# EAGLE design Spannungsversorgung (EAGLE 4.16)
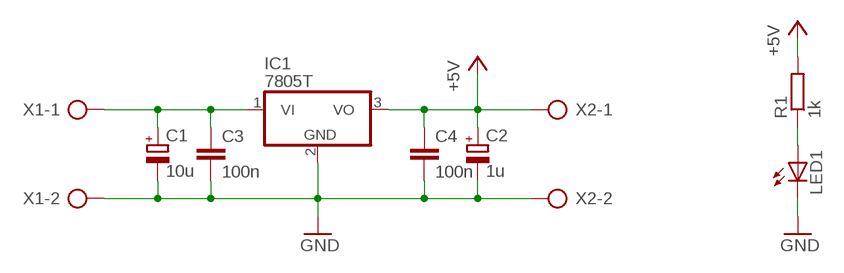
[diagram p0: schematic, sheet 1]

## Parts
C1  10u  CPOL-EUE2.5-7  [E2,5-7]
C2  1u  CPOL-EUE2.5-7  [E2,5-7]
C3  100n  C-EU025-030X050  [C025-030X050]
C4  100n  C-EU025-030X050  [C025-030X050]
IC1  7805T  [TO220H]
LED1  LED3MM  [LED3MM]
R1  1k  R-EU_0204/7  [0204/7]
X1  AK500/2  [AK500/2]
X2  AK500/2  [AK500/2]

## Nets
+5V: C2.+ C4.1 IC1.3(VO) R1.2 X2.1
GND: C1.- C2.- C3.2 C4.2 IC1.2(GND) LED1.K(C) X1.2 X2.2
N$1: C1.+ C3.1 IC1.1(VI) X1.1
N$2: LED1.A R1.1

## Library data of the parts
C1 C2 = rcl:CPOL-EU: POLARIZED CAPACITOR, European symbol
C3 C4 = rcl:C-EU: CAPACITOR, European symbol
IC1 = linear:78*: Positive VOLTAGE REGULATOR Source: http://cache.national.com/ds/LM/LM78L05.pdf http://www.fairchildsemi.com/ds/LM/LM7805.pdf
LED1 = led:LED: LED OSRAM: - CHIPLED LG R971, LG N971, LY N971, LG Q971, LY Q971, LO R971, LY R971 LH N974, LH R974 LS Q976, LO Q976, LY Q976 LO Q996 - Hyper CHIPLED LW Q18S LB Q993, LB Q99A, LB R99A - SideLED LS A670, LO A670, LY A670, LG A670, LP A670 LB A673, LV A673, LT A673, LW A673 LH A674 LY A675 LS A676, LA A676, LO A676, LY A676, LW A676 LS A679, LY A679, LG A679 - Hyper Micro SIDELED® LS Y876, LA Y876, LO Y876, LY Y876 LT Y87S - SmartLED LW L88C, LW L88S LB L89C, LB L89S, LG L890 LS L89K, LO L89K, LY L89K LS L896, LA L896, LO L896, LY L896 - TOPLED LS T670, LO T670, LY T670, LG T670, LP T670 LSG T670, LSP T670, LSY T670, LOP T670, LYG T670 LG T671, LOG T671, LSG T671 LB T673, LV T673, LT T673, LW T673 LH T674 LS T676, LA T676, LO T676, LY T676, LB T676, LH T676, LSB T676, LW T676 LB T67C, LV T67C, LT T67C, LS T67K, LO T67K, LY T67K, LW E67C LS E67B, LA E67B, LO E67B, LY E67B, LB E67C, LV E67C, LT E67C LW T67C LS T679, LY T679, LG T679 LS T770, LO T770, LY T770, LG T770, LP T770 LB T773, LV T773, LT T773, LW T773 LH T774 LS E675, LA E675, LY E675, LS T675 LS T776, LA T776, LO T776, LY T776, LB T776 LHGB T686 LT T68C, LB T68C - Hyper Mini TOPLED® LB M676 - Mini TOPLED Santana® LG M470 LS M47K, LO M47K, LY M47K Source: http://www.osram.convergy.de/
R1 = rcl:R-EU_: RESISTOR, European symbol
X1 X2 = con-ptr500:AK500/2: CONNECTOR

## Board
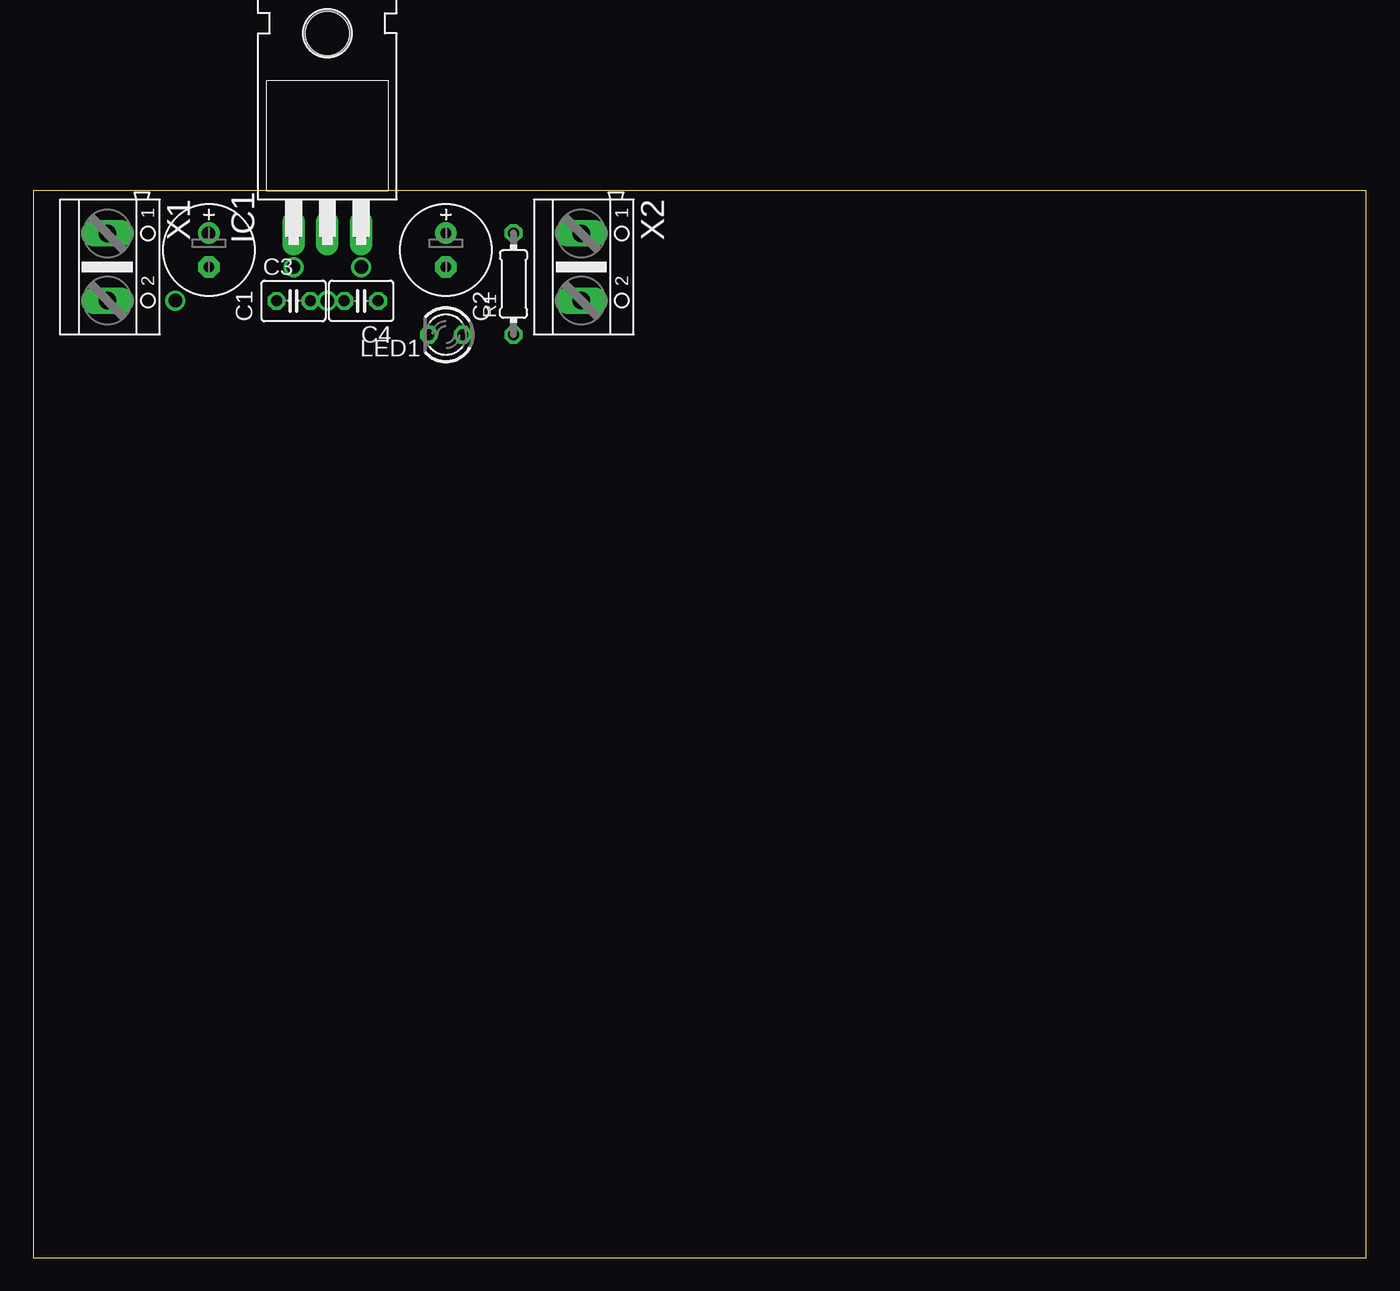
[diagram p1: board, top side]
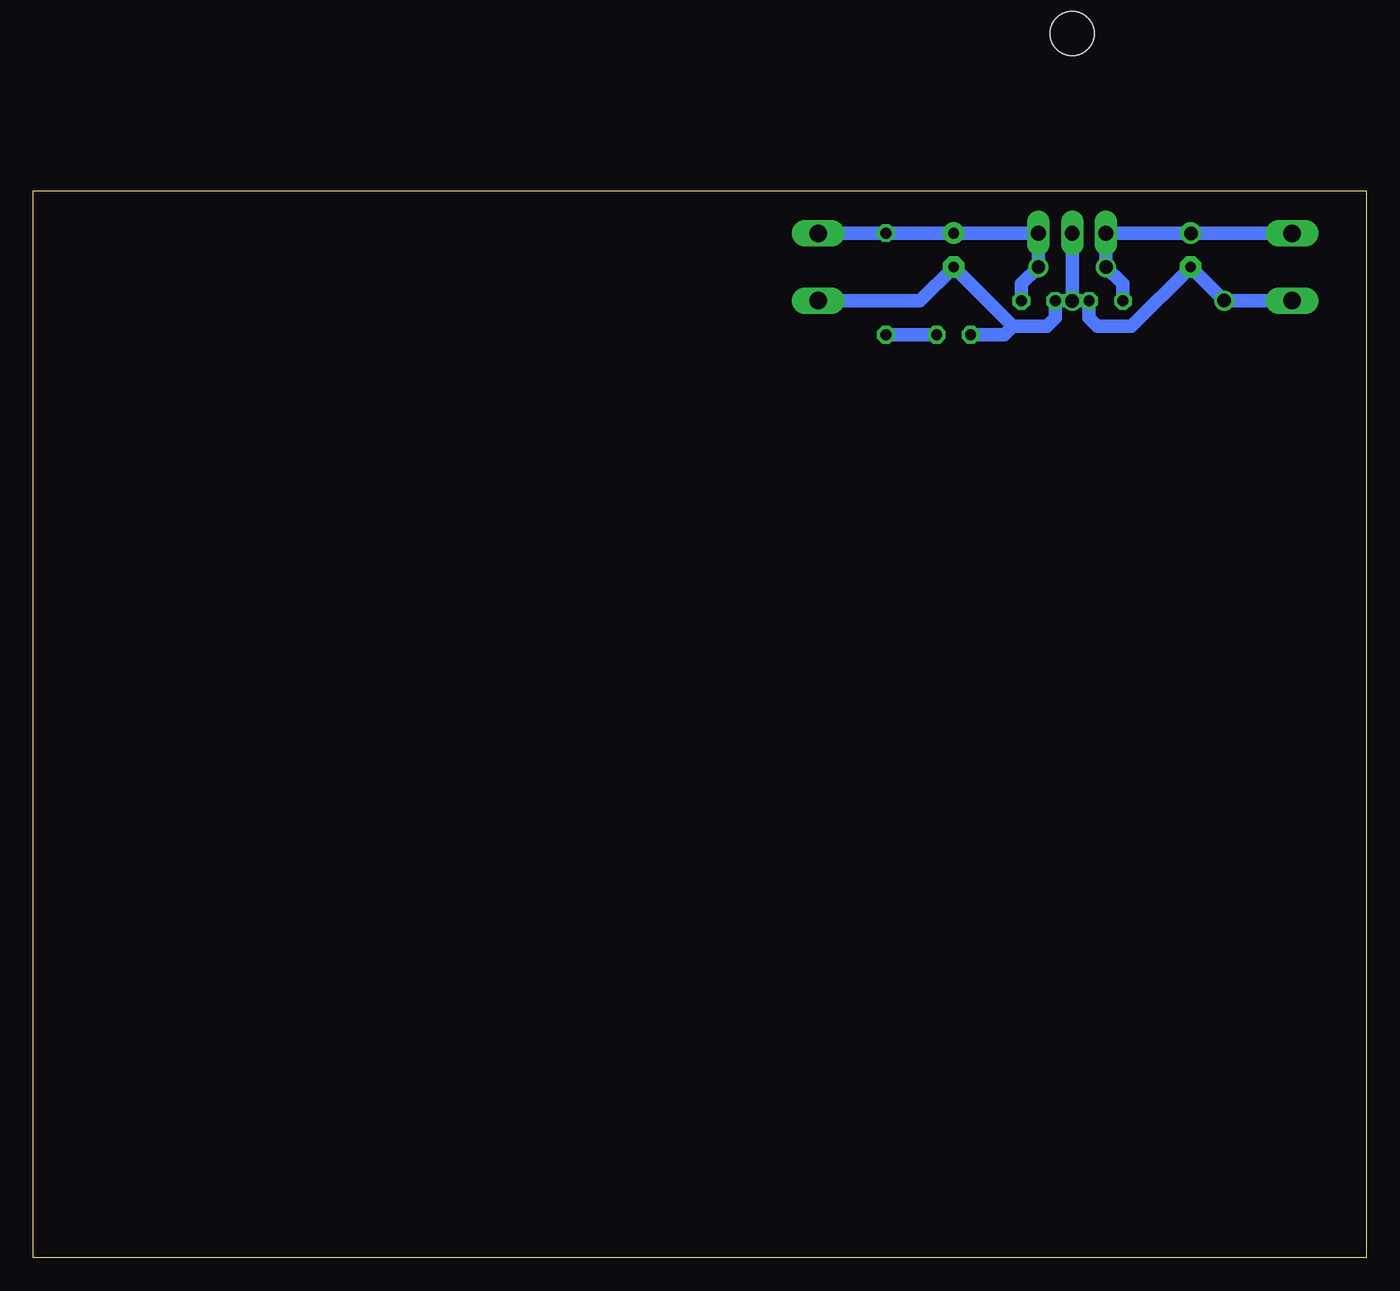
[diagram p2: board, bottom side, seen from below]

Size 100 x 80 mm. Coordinates in mm from the lower left corner, seen from the top.
Outline: 0,0 100,0 100,80 0,80 0,0
Copper layers (1*16): Top 0.035mm / dielectric 1.5mm / Bottom 0.035mm
Design rules "default": minimum track width 10mil, minimum drill 24mil, track to track 8mil, track to pad 8mil, pad to pad 8mil, via to via 8mil, smd to smd 8mil, copper to edge 40mil, drill to drill 8mil, minimum pad ring 10mil, minimum via ring 8mil, stop-mask expansion 4mil, vias tented up to drill 0mil, thermal gap 10mil

### Footprints (pad centres in the part's own frame; a part is rotated, then mirrored left to right if it is on the bottom)
E2,5-7 = drill 0.813 pad 1.6 round: + -1.27,0 | drill 0.813 pad 1.6 octagon: - 1.27,0
C025-030X050 = drill 0.813 octagon: 1 -1.27,0; 2 1.27,0
TO220H = drill 1.118 long: 1 -2.54,-10.16; 2 0,-10.16; 3 2.54,-10.16 | hole 3.302: 0,4.826
LED3MM = drill 0.813 octagon: A -1.27,0; K 1.27,0
0204/7 = drill 0.813 octagon: 1 -3.81,0; 2 3.81,0
AK500/2 = drill 1.321 long: 1 -2.515,0; 2 2.515,0

### Placement (x,y rotation side)
C1  13.17,75.56 270 top
C2  30.95,75.56 270 top
C3  19.52,71.75 0 top
C4  24.6,71.75 180 top
IC1  22.06,86.99 0 top
LED1  30.95,69.21 180 top
R1  36.03,73.02 90 top
X1  5.55,74.29 270 top
X2  41.11,74.29 270 top

### Tracks (layer width: path | path; a pad name or v marks a point on that pad's centre or on a via)
+5V  (via drill 1)
  Bottom 1.016: X2.1 32.24,76.8 C2.+ | C2.+ IC1.3 v24.6,74.29 25.87,73.02 C4.1 | C2.+ R1.2
GND  (via drill 1)
  Bottom 1.016: X1.2 v10.66,71.77 C1.- 17.61,69.84 20.15,69.84 20.79,70.48 C3.2 v22.06,71.75 | v22.06,71.75 C4.2 23.33,70.48 23.96,69.84 26.5,69.84 | v22.06,71.75 IC1.2 | 26.5,69.84 C2.- 33.46,71.77 X2.2 | LED1.K 27.14,69.21 26.5,69.84
N$1  (via drill 1)
  Bottom 1.016: X1.1 v13.15,76.8 C1.+ IC1.1 v19.52,74.29 18.25,73.02 C3.1
N$2
  Bottom 1.016: R1.1 LED1.A